# EAGLE design Atmega1280_xmem_512K (EAGLE 7.1.0)
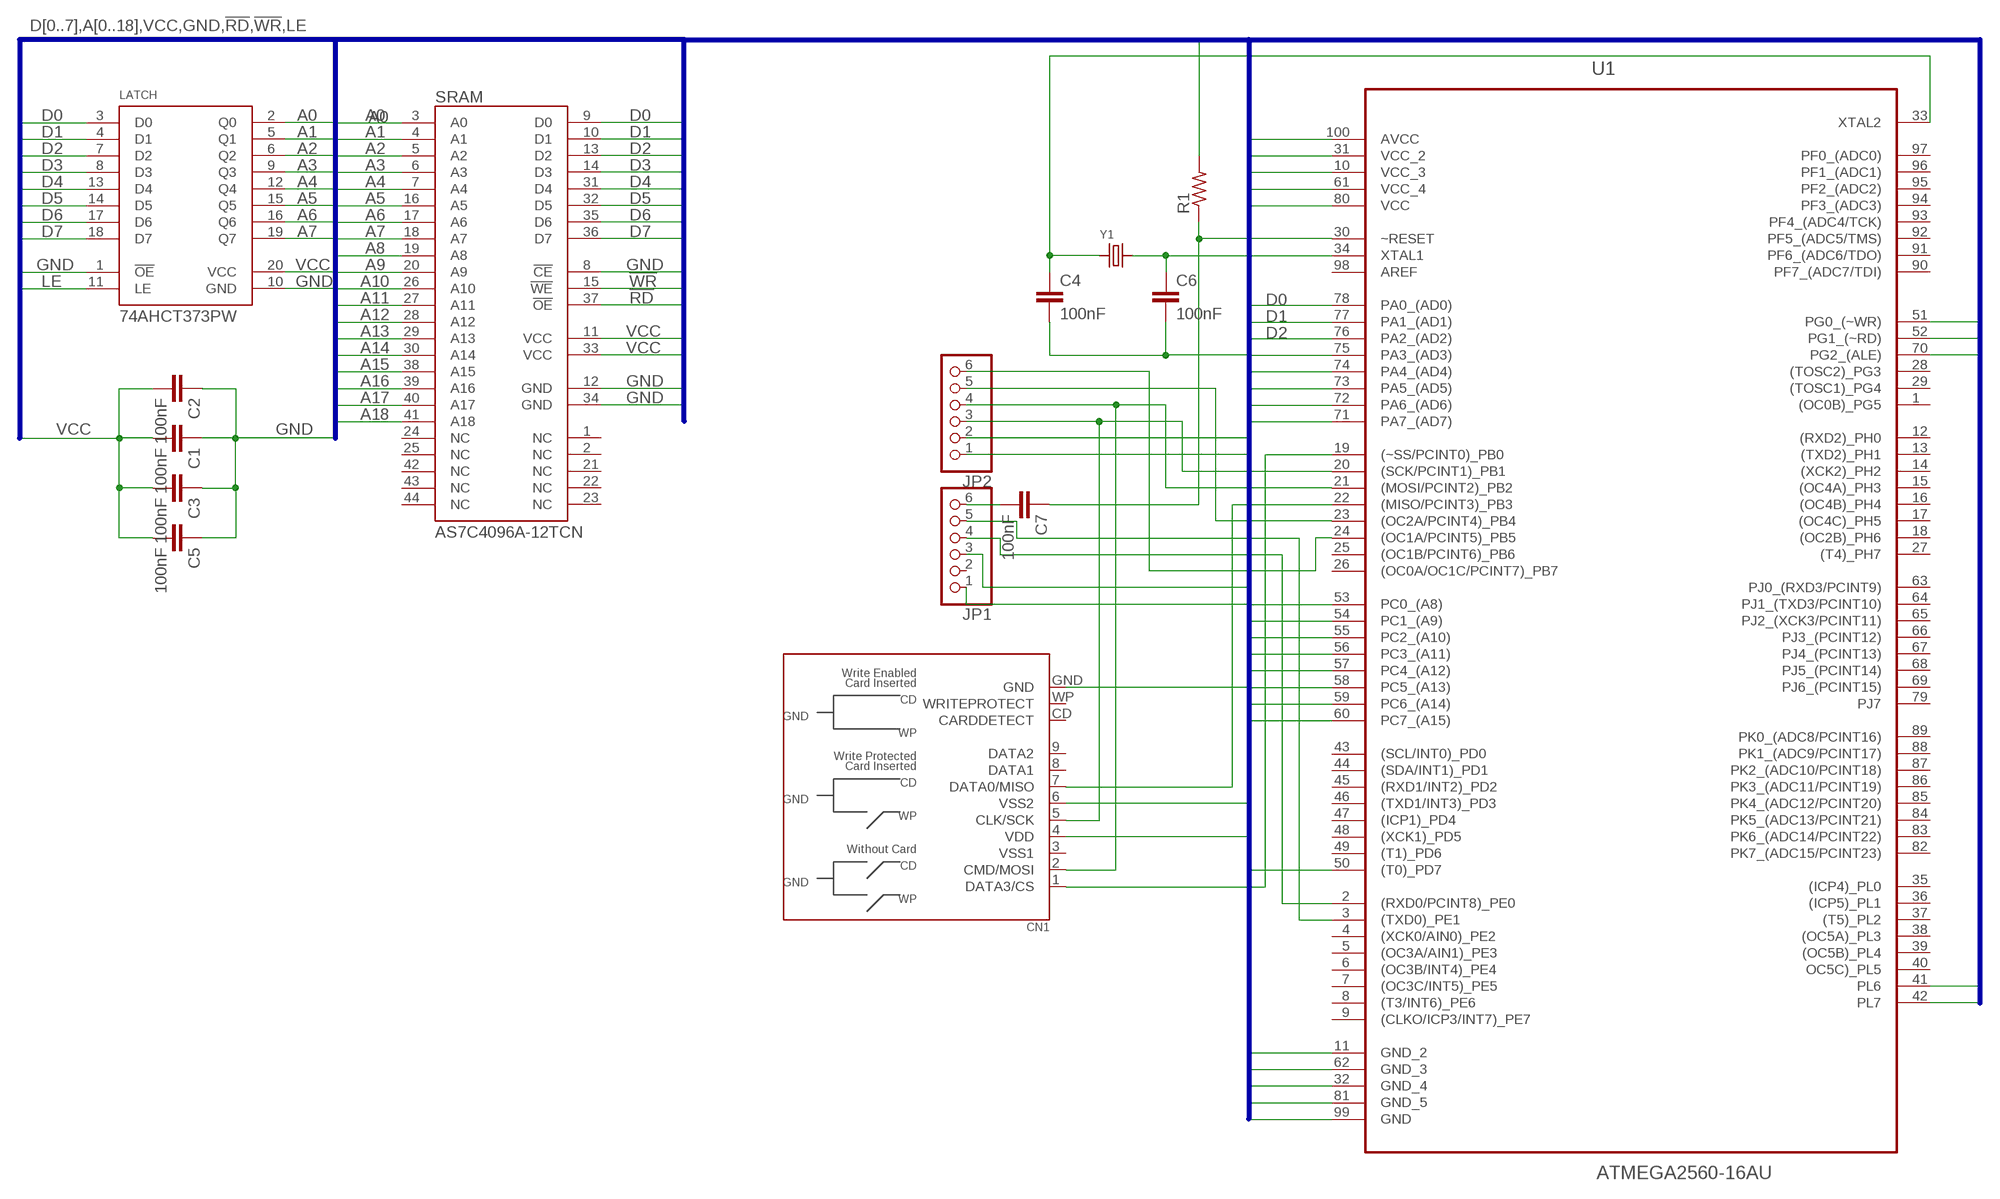
[diagram p0: schematic, sheet 1]

## Parts
C1  100nF  C-EUC0603  [C0603]
C2  100nF  C-EUC0603  [C0603]
C3  100nF  C-EUC0603  [C0603]
C4  100nF  C-EUC0603  [C0603]
C5  100nF  C-EUC0603  [C0603]
C6  100nF  C-EUC0603  [C0603]
C7  100nF  C-EUC0603  [C0603]
CN1  SDCARD  [SDCARD_SMT_4U06132]
JP1  HEADER-1X6  [1X06_OVAL]
JP2  HEADER-1X6  [1X06_OVAL]
LATCH  74AHCT373PW  [TSSOP20]
R1  R-US_R0603  [R0603]
SRAM  AS7C4096A-12TCN  [TSOP44-II]
U1  ATMEGA2560-16AU  [QFP50P1600X1600X120-100N]
Y1  CRYSTALSMD  [HC49UP]

## Nets
!RD: SRAM.37(!OE) U1.52(PG1_(~RD))
!WR: SRAM.15(!WE) U1.51(PG0_(~WR))
A0: LATCH.2(Q0) SRAM.3(A0)
A1: LATCH.5(Q1) SRAM.4(A1)
A2: LATCH.6(Q2) SRAM.5(A2)
A3: LATCH.9(Q3) SRAM.6(A3)
A4: LATCH.12(Q4) SRAM.7(A4)
A5: LATCH.15(Q5) SRAM.16(A5)
A6: LATCH.16(Q6) SRAM.17(A6)
A7: LATCH.19(Q7) SRAM.18(A7)
A8: SRAM.19(A8) U1.53(PC0_(A8))
A9: SRAM.20(A9) U1.54(PC1_(A9))
A10: SRAM.26(A10) U1.55(PC2_(A10))
A11: SRAM.27(A11) U1.56(PC3_(A11))
A12: SRAM.28(A12) U1.57(PC4_(A12))
A13: SRAM.29(A13) U1.58(PC5_(A13))
A14: SRAM.30(A14) U1.59(PC6_(A14))
A15: SRAM.38(A15) U1.60(PC7_(A15))
A16: SRAM.39(A16) U1.50((T0)_PD7)
A17: SRAM.40(A17) U1.42(PL7)
A18: SRAM.41(A18) U1.41(PL6)
D0: LATCH.3(D0) SRAM.9(D0) U1.78(PA0_(AD0))
D1: LATCH.4(D1) SRAM.10(D1) U1.77(PA1_(AD1))
D2: LATCH.7(D2) SRAM.13(D2) U1.76(PA2_(AD2))
D3: LATCH.8(D3) SRAM.14(D3) U1.75(PA3_(AD3))
D4: LATCH.13(D4) SRAM.31(D4) U1.74(PA4_(AD4))
D5: LATCH.14(D5) SRAM.32(D5) U1.73(PA5_(AD5))
D6: LATCH.17(D6) SRAM.35(D6) U1.72(PA6_(AD6))
D7: LATCH.18(D7) SRAM.36(D7) U1.71(PA7_(AD7))
GND [power]: C1.1 C2.1 C3.1 C4.2 C5.1 C6.2 CN1.6(VSS2) CN1.GND JP1.1 JP2.1 LATCH.1(!OE) LATCH.10(GND) SRAM.8(!CE) SRAM.12(GND) SRAM.34(GND) U1.11(GND_2) U1.32(GND_4) U1.62(GND_3) U1.81(GND_5) U1.99(GND)
LE: LATCH.11(LE) U1.70(PG2_(ALE))
N$2: C6.1 U1.34(XTAL1) Y1.2
N$3: C4.1 U1.33(XTAL2) Y1.1
N$4: C7.1 R1.1 U1.30(~RESET)
N$5: C7.2 JP1.6
N$6: JP1.5 U1.3((TXD0)_PE1)
N$7: JP1.4 U1.2((RXD0/PCINT8)_PE0)
N$8: CN1.5(CLK/SCK) JP2.3 U1.20((SCK/PCINT1)_PB1)
N$9: CN1.2(CMD/MOSI) JP2.4 U1.21((MOSI/PCINT2)_PB2)
N$10: JP2.5 U1.23((OC2A/PCINT4)_PB4)
N$11: JP2.6 U1.24((OC1A/PCINT5)_PB5)
N$12: CN1.7(DATA0/MISO) U1.22((MISO/PCINT3)_PB3)
N$13: CN1.1(DATA3/CS) U1.19((~SS/PCINT0)_PB0)
VCC [power]: C1.2 C2.2 C3.2 C5.2 CN1.4(VDD) JP1.3 JP2.2 LATCH.20(VCC) R1.2 SRAM.11(VCC) SRAM.33(VCC) U1.10(VCC_3) U1.31(VCC_2) U1.61(VCC_4) U1.80(VCC) U1.100(AVCC)
Unconnected: CN1.3(VSS1) CN1.8(DATA1) CN1.9(DATA2) CN1.CD(CARDDETECT) CN1.WP(WRITEPROTECT) JP1.2 SRAM.1(NC) SRAM.2(NC) SRAM.21(NC) SRAM.22(NC) SRAM.23(NC) SRAM.24(NC) SRAM.25(NC) SRAM.42(NC) SRAM.43(NC) SRAM.44(NC) U1.1((OC0B)_PG5) U1.4((XCK0/AIN0)_PE2) U1.5((OC3A/AIN1)_PE3) U1.6((OC3B/INT4)_PE4) U1.7((OC3C/INT5)_PE5) U1.8((T3/INT6)_PE6) U1.9((CLKO/ICP3/INT7)_PE7) U1.12((RXD2)_PH0) U1.13((TXD2)_PH1) U1.14((XCK2)_PH2) U1.15((OC4A)_PH3) U1.16((OC4B)_PH4) U1.17((OC4C)_PH5) U1.18((OC2B)_PH6) U1.25((OC1B/PCINT6)_PB6) U1.26((OC0A/OC1C/PCINT7)_PB7) U1.27((T4)_PH7) U1.28((TOSC2)_PG3) U1.29((TOSC1)_PG4) U1.35((ICP4)_PL0) U1.36((ICP5)_PL1) U1.37((T5)_PL2) U1.38((OC5A)_PL3) U1.39((OC5B)_PL4) U1.40(OC5C)_PL5) U1.43((SCL/INT0)_PD0) U1.44((SDA/INT1)_PD1) U1.45((RXD1/INT2)_PD2) U1.46((TXD1/INT3)_PD3) U1.47((ICP1)_PD4) U1.48((XCK1)_PD5) U1.49((T1)_PD6) U1.63(PJ0_(RXD3/PCINT9)) U1.64(PJ1_(TXD3/PCINT10)) U1.65(PJ2_(XCK3/PCINT11)) U1.66(PJ3_(PCINT12)) U1.67(PJ4_(PCINT13)) U1.68(PJ5_(PCINT14)) U1.69(PJ6_(PCINT15)) U1.79(PJ7) U1.82(PK7_(ADC15/PCINT23)) U1.83(PK6_(ADC14/PCINT22)) U1.84(PK5_(ADC13/PCINT21)) U1.85(PK4_(ADC12/PCINT20)) U1.86(PK3_(ADC11/PCINT19)) U1.87(PK2_(ADC10/PCINT18)) U1.88(PK1_(ADC9/PCINT17)) U1.89(PK0_(ADC8/PCINT16)) U1.90(PF7_(ADC7/TDI)) U1.91(PF6_(ADC6/TDO)) U1.92(PF5_(ADC5/TMS)) U1.93(PF4_(ADC4/TCK)) U1.94(PF3_(ADC3)) U1.95(PF2_(ADC2)) U1.96(PF1_(ADC1)) U1.97(PF0_(ADC0)) U1.98(AREF)

## Buses
D[0..7],A[0..18],VCC,GND,!RD,!WR,LE

## Library data of the parts
C1-C7 = resistor:C-EU: CAPACITOR, European symbol
CN1 = microbuilder:SDCARD: SD Card Reader 06132 = Inexpensive SMT 19646 = Push/Pull SMT
JP1 JP2 = OLED_mod:HEADER-1X6: PIN HEADER
LATCH = andy:74AHCT373PW
R1 = resistor:R-US_: RESISTOR, American symbol
SRAM = andy:AS7C4096A-12TCN
U1 = Atmel_By_element14_Batch_1-00:ATMEGA2560-16AU: Microcontroller; DESCRIPTION: Microcontroller; MPN: ATMEGA2560-16AU; OC_FARNELL: 1288330; OC_NEWARK: 23M5051; PACKAGE: LQFP-100; SUPPLIER: ATMEL
Y1 = OLED_mod:CRYSTAL: Crystals HC49UP - Surface Mount Crystal 4.0MHz 18pF +/-30ppm Surface Mount Crystal [Digikey: 535-9857-1-ND] 12.0 MHz Surface Mount Crystal [Digikey: 535-9869-6-ND] 25.0 MHz Surface Mount Crystal [Digikey: 535-9078-1-ND] 2.5 x 2.0mm - MEMs SMT Crystal 16.0 MHz 10pF 20ppm 2.5 x 2.0mm Crystal [Digikey -40-85°C: 535-10923-1-ND] 3.2 x 2.5mm - MEMs SMT Crystal 12.0 MHz 8pF 15ppm 3.2 x 2.5mm Crystal [Digikey: -10-70°C: 644-1047-1-ND -40-125°C: 644-1128-1-ND] 16.0 MHz 8pF 15ppm 3.2 x 2.5mm Crystal [Digikey: -10-70°C: 644-1049-1-ND -40-125°C: 644-1129-2-ND] 16.0 MHz 10pF 10ppm 3.2 x 2.5mm Crystal [Digikey: 644-1100-1-ND] 27.12 MHz 18pF 30ppm 3.2 x 2.5mm Crystal [Digikey: 887-1424-1-ND] 27.12MHz 10pF 10ppm 3.2 x 2.5mm Crystal [Digikey: 887-1329-1-ND] 4.9 x 1.8mm - MEMs SMT Crystal 32.768 KHz 12.5pF 20ppm 4.9 x 1.8mm Crystal [Digikey: SE2415CT-ND] 8.0 x 3.8mm - Surface Mount Crystal 32.768kHz 12.5pF 20ppm -40°C-85°C [Digikey: 535-9166-2-ND] Cylinder 32.768KHz Cylinder Crystal (2x6mm body) [Ex. Digikey: 300-8341-2-ND]

## Net classes
0 default: width 0.254 mm
1 power: width 0.406 mm

## Board
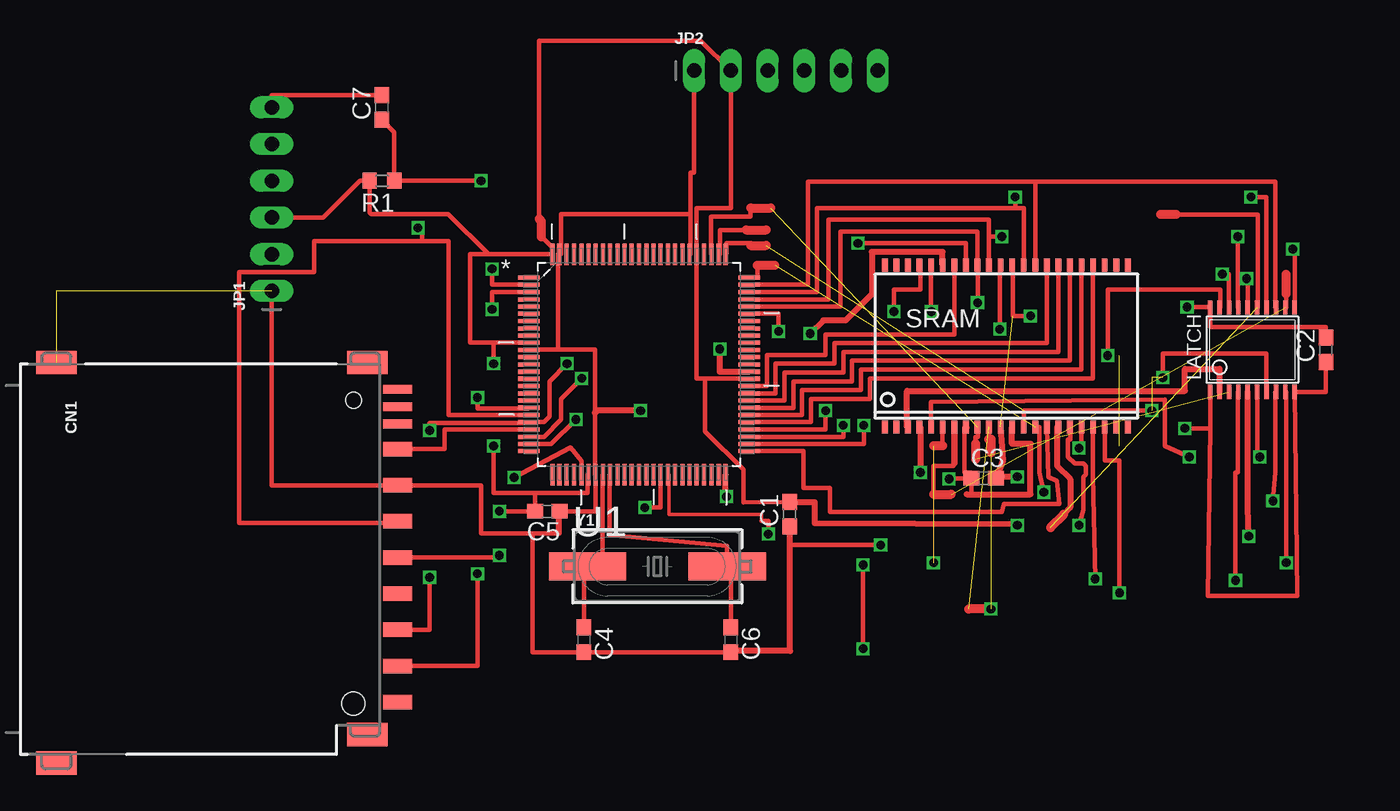
[diagram p1: board, top side]
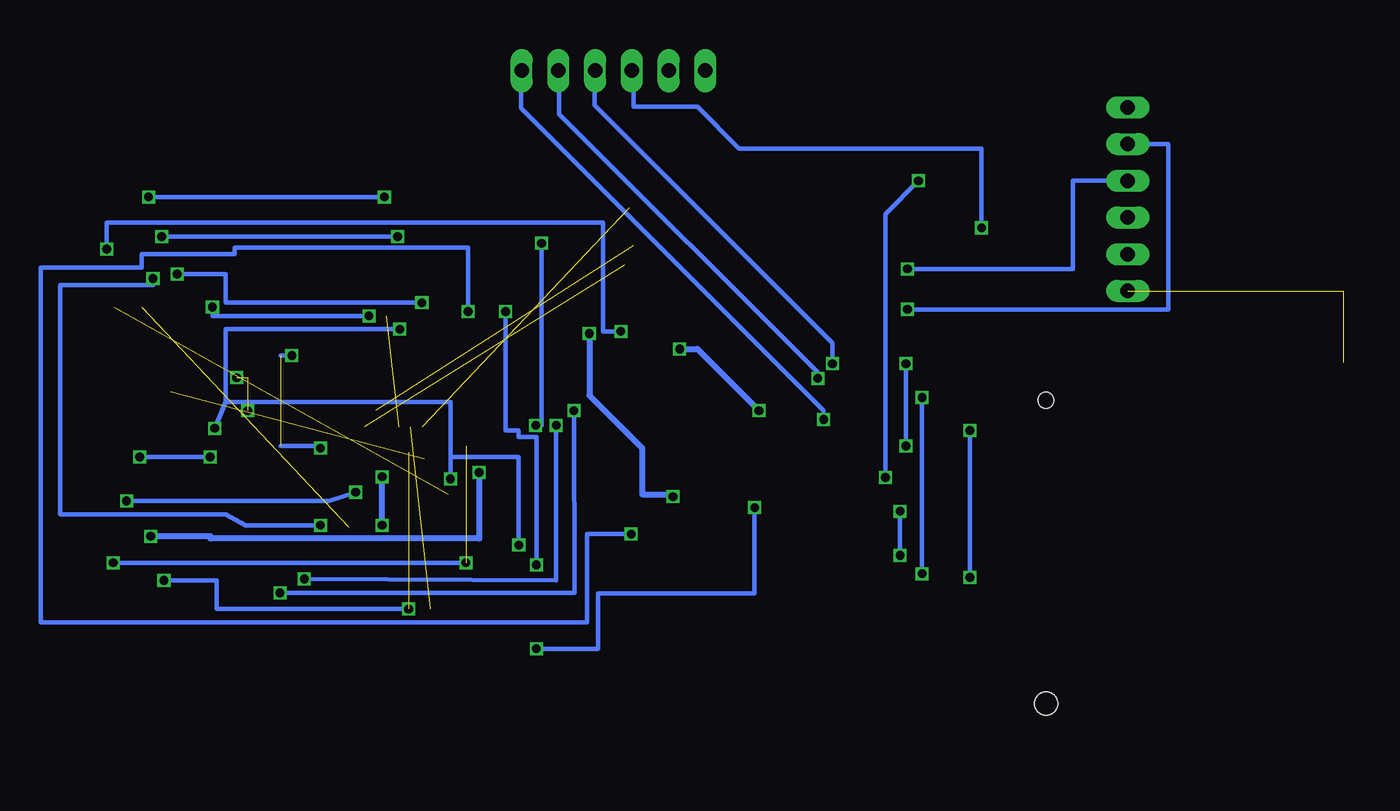
[diagram p2: board, bottom side, seen from below]

No outline drawn. Coordinates in mm, seen from the top.
Copper layers (1*16): Top 0.035mm / dielectric 1.5mm / Bottom 0.035mm
Design rules "ITead_rule *": minimum track width 10mil, minimum drill 16mil, track to track 10mil, track to pad 10mil, pad to pad 6mil, via to via 6mil, smd to smd 0mil, copper to edge 12mil, drill to drill 12mil, minimum pad ring 10mil, minimum via ring 6mil, stop-mask expansion 2mil, vias tented up to drill 100mil, thermal gap 10mil
vRestrict: area 82.5,-10.2 to 92.7,7.6; area 78,8.4 to 85.6,13.5

### Footprints (pad centres in the part's own frame; a part is rotated, then mirrored left to right if it is on the bottom)
C0603 = smd 1.1 x 1: 1 -0.85,0; 2 0.85,0
SDCARD_SMT_4U06132 = smd 1 x 2.008: 1 6.88,11.254; 2 4.38,11.254; 3 1.88,11.254; 4 -0.62,11.254; 5 -3.12,11.254; 6 -5.62,11.254; 7 -8.12,11.254; 9 9.38,11.254 | smd 0.6 x 2.008: 8 -9.845,11.254; CD -11.045,11.254; WP -12.245,11.254 | smd 1.6 x 2.8: GND -14.1,-12.35; NC1 -14.1,9.15; NC2 11.631,9.15; NC3 13.6,-12.35 | hole 1.6: 9.5,8.2 | hole 1.1: -11.5,8.2
1X06_OVAL = drill 1 long: 1 -6.35,0; 2 -3.81,0; 3 -1.27,0; 4 1.27,0; 5 3.81,0; 6 6.35,0
TSSOP20 = smd 0.305 x 0.991: 1 -2.925,-2.918; 2 -2.275,-2.918; 3 -1.625,-2.918; 4 -0.975,-2.918; 5 -0.325,-2.918; 6 0.325,-2.918; 7 0.975,-2.918; 8 1.625,-2.918; 9 2.275,-2.918; 10 2.925,-2.918; 11 2.925,2.918; 12 2.275,2.918; 13 1.625,2.918; 14 0.975,2.918; 15 0.325,2.918; 16 -0.325,2.918; 17 -0.975,2.918; 18 -1.625,2.918; 19 -2.275,2.918; 20 -2.925,2.918
R0603 = smd 1 x 1.1: 1 -0.85,0; 2 0.85,0
TSOP44-II = smd 0.4 x 0.9: 1 -8.4,-5.6; 2 -7.6,-5.6; 3 -6.8,-5.6; 4 -6,-5.6; 5 -5.2,-5.6; 6 -4.4,-5.6; 7 -3.6,-5.6; 8 -2.8,-5.6; 9 -2,-5.6; 10 -1.2,-5.6; 11 -0.4,-5.6; 12 0.4,-5.6; 13 1.2,-5.6; 14 2,-5.6; 15 2.8,-5.6; 16 3.6,-5.6; 17 4.4,-5.6; 18 5.2,-5.6; 19 6,-5.6; 20 6.8,-5.6; 21 7.6,-5.6; 22 8.4,-5.6; 23 8.4,5.6; 24 7.6,5.6; 25 6.8,5.6; 26 6,5.6; 27 5.2,5.6; 28 4.4,5.6; 29 3.6,5.6; 30 2.8,5.6; 31 2,5.6; 32 1.2,5.6; 33 0.4,5.6; 34 -0.4,5.6; 35 -1.2,5.6; 36 -2,5.6; 37 -2.8,5.6; 38 -3.6,5.6; 39 -4.4,5.6; 40 -5.2,5.6; 41 -6,5.6; 42 -6.8,5.6; 43 -7.6,5.6; 44 -8.4,5.6
QFP50P1600X1600X120-100N = smd 1.473 x 0.279: 1 -7.62,5.994; 2 -7.62,5.512; 3 -7.62,5.004; 4 -7.62,4.496; 5 -7.62,3.988; 6 -7.62,3.505; 7 -7.62,2.997; 8 -7.62,2.489; 9 -7.62,2.007; 10 -7.62,1.499; 11 -7.62,0.991; 12 -7.62,0.508; 13 -7.62,0; 14 -7.62,-0.508; 15 -7.62,-0.991; 16 -7.62,-1.499; 17 -7.62,-2.007; 18 -7.62,-2.489; 19 -7.62,-2.997; 20 -7.62,-3.505; 21 -7.62,-3.988; 22 -7.62,-4.496; 23 -7.62,-5.004; 24 -7.62,-5.512; 25 -7.62,-5.994; 51 7.62,-5.994; 52 7.62,-5.512; 53 7.62,-5.004; 54 7.62,-4.496; 55 7.62,-3.988; 56 7.62,-3.505; 57 7.62,-2.997; 58 7.62,-2.489; 59 7.62,-2.007; 60 7.62,-1.499; 61 7.62,-0.991; 62 7.62,-0.508; 63 7.62,0; 64 7.62,0.508; 65 7.62,0.991; 66 7.62,1.499; 67 7.62,2.007; 68 7.62,2.489; 69 7.62,2.997; 70 7.62,3.505; 71 7.62,3.988; 72 7.62,4.496; 73 7.62,5.004; 74 7.62,5.512; 75 7.62,5.994 | smd 0.279 x 1.473: 26 -5.994,-7.62; 27 -5.512,-7.62; 28 -5.004,-7.62; 29 -4.496,-7.62; 30 -3.988,-7.62; 31 -3.505,-7.62; 32 -2.997,-7.62; 33 -2.489,-7.62; 34 -2.007,-7.62; 35 -1.499,-7.62; 36 -0.991,-7.62; 37 -0.508,-7.62; 38 0,-7.62; 39 0.508,-7.62; 40 0.991,-7.62; 41 1.499,-7.62; 42 2.007,-7.62; 43 2.489,-7.62; 44 2.997,-7.62; 45 3.505,-7.62; 46 3.988,-7.62; 47 4.496,-7.62; 48 5.004,-7.62; 49 5.512,-7.62; 50 5.994,-7.62; 76 5.994,7.62; 77 5.512,7.62; 78 5.004,7.62; 79 4.496,7.62; 80 3.988,7.62; 81 3.505,7.62; 82 2.997,7.62; 83 2.489,7.62; 84 2.007,7.62; 85 1.499,7.62; 86 0.991,7.62; 87 0.508,7.62; 88 0,7.62; 89 -0.508,7.62; 90 -0.991,7.62; 91 -1.499,7.62; 92 -2.007,7.62; 93 -2.489,7.62; 94 -2.997,7.62; 95 -3.505,7.62; 96 -3.988,7.62; 97 -4.496,7.62; 98 -5.004,7.62; 99 -5.512,7.62; 100 -5.994,7.62
HC49UP = smd 5.334 x 1.93: 1 -4.826,0; 2 4.826,0

### Placement (x,y rotation side)
C1  53.59,23.93 90 top
C2  90.68,35.31 90 top
C3  67.01,26.42 0 top
C4  39.37,15.24 270 top
C5  36.83,24.13 180 top
C6  49.53,15.24 270 top
C7  25.4,52.07 90 top
CN1  15.24,20.32 270 top
JP1  17.78,45.72 90 top
JP2  53.34,54.61 0 top
LATCH  85.6,35.31 0 top
R1  25.4,46.99 180 top
SRAM  68.58,35.56 0 top
U1  43.18,34.29 0 top
Y1  44.45,20.32 0 top

### Tracks (layer width: path | path; a pad name or v marks a point on that pad's centre or on a via)
!RD  (via drill 0.6)
  Top 0.305: U1.52 58.73,28.78 v58.73,30.07 | v58.32,42.67 65.78,42.67 SRAM.37
  Bottom 0.305: v58.73,30.07 58.32,30.07 v58.32,42.67
!WR
  Top 0.305: U1.51 54.56,28.3 54.56,25.76 56.39,25.76 56.39,24.08 68.28,24.08 68.43,24.64 72.24,24.64 72.08,26.21 71.48,26.52 SRAM.15
A0
  Top 0.406: SRAM.3 61.72,29.96 61.72,32.46 80.92,32.46 80.92,33.98 83.32,33.98 LATCH.2
A1  (via drill 0.6)
  Top 0.406: SRAM.4 62.64,29.96 v62.64,26.82 | v85.34,22.4 85.27,24.38 LATCH.5
  Bottom 0.406: v62.64,26.82 62.64,22.25 81.23,22.25 81.23,22.4 v85.34,22.4
A2  (via drill 0.6)
  Top 0.305: SRAM.5 63.38,31.68 63.4,31.7 79.55,31.85 79.55,28.65 v81.23,27.89 | v86.11,27.89 85.92,28.35 LATCH.6
  Bottom 0.305: v81.23,27.89 v86.11,27.89
A3  (via drill 0.6)  (1 unrouted)
  Top 0.305: LATCH.9 87.94,32.39 v87.94,20.57 | SRAM.6 64.16,29.96 64.16,28.65
  Top 0.61: 64.16,28.65 63.55,28.65
  Bottom 0.305: v87.94,20.57 v63.55,20.57
A4  (1 unrouted)
  Top 0.305: 64.92,27.28 65.08,27.43 65.08,29.96 SRAM.7 64.92,29.96 64.92,27.28 | 63.55,25.3 63.55,27.28 64.92,27.28 | LATCH.12 87.94,38.22 87.94,39.17
  Top 0.61: 87.94,39.17 87.94,40.54 | 63.55,25.3 64.77,25.3
A5  (1 unrouted)
  Top 0.305: LATCH.15 85.95,38.22 85.95,44.65 80.31,44.65
  Top 0.406: SRAM.16 72.08,29.96 72.08,27.28 73,26.36 73,24.38 72.54,23.93
  Top 0.61: 80.31,44.65 79.25,44.65 | 72.54,23.93 71.63,23.01
A6  (via drill 0.6)
  Top 0.305: SRAM.17 73,29.96 73,29.11 72.85,29.11 72.85,27.89 73.3,27.43 73.91,27.43 74.07,27.28 74.07,26.67 73.91,26.52 73.91,24.23 v73.61,23.16 | v85.19,40.23 85.27,40.23 LATCH.16
  Bottom 0.305: v73.61,23.16 78.79,23.16 80.16,23.93 91.59,23.93 91.59,39.78 85.19,39.78 v85.19,40.23
A7  (via drill 0.6)  (1 unrouted)
  Top 0.305: LATCH.19 83.36,38.22 83.36,39.47 75.59,39.47 v75.59,34.9 | v73.61,28.5 73.78,28.8 SRAM.18
  Bottom 0.305: v75.59,34.9 76.35,34.9 | 76.35,28.65 73.46,28.65 v73.61,28.5
A8  (via drill 0.6)
  Top 0.305: U1.53 57.3,29.29 v57.3,30.07 | v74.73,19.46 74.58,26.62 SRAM.19
  Bottom 0.305: v57.3,30.07 57.3,19.36 v74.73,19.46
A9  (via drill 0.6)
  Top 0.305: U1.54 56.08,29.79 v56.08,31.09 | v76.4,18.49 76.4,27.64 75.38,27.64 SRAM.20
  Bottom 0.305: v56.08,31.09 56.03,18.49 v76.4,18.49
A10
  Top 0.305: U1.55 55.07,30.3 55.07,31.9 59.13,31.9 59.13,33.33 74.58,33.33 SRAM.26
A11
  Top 0.305: U1.56 54.46,30.79 54.46,32.51 58.52,32.51 58.52,33.93 73.78,33.93 SRAM.27
A12
  Top 0.305: U1.57 53.85,31.29 53.85,33.12 57.91,33.12 57.91,34.54 72.98,34.54 SRAM.28
A13
  Top 0.305: U1.58 53.24,31.8 53.24,33.73 57.3,33.73 57.3,35.15 72.18,35.15 SRAM.29
A14
  Top 0.305: U1.59 52.63,32.28 52.63,34.34 56.69,34.34 56.69,35.76 71.38,35.76 SRAM.30
A15
  Top 0.305: U1.60 52.02,32.79 52.02,34.95 56.08,34.95 56.08,36.37 64.98,36.37 SRAM.38
A16  (via drill 0.6)
  Top 0.406: SRAM.39 64.16,41.16 64.16,42.06 59.28,42.06 59.28,39.17 57.45,37.34 55.93,37.34 v55.02,36.42 | v49.23,25.15 49.17,25.15 U1.50
  Bottom 0.406: v55.02,36.42 55.02,32.16 51.36,28.5 51.36,25.3 49.23,25.3 v49.23,25.15
A17  (via drill 0.6)
  Top 0.254: U1.42 45.26,26.67 45.26,23.93 51.66,23.93 51.66,23.47
  Top 0.305: 51.66,23.47 52.12,23.47 v52.12,22.55 | v63.4,37.95 63.38,37.95 SRAM.40
  Bottom 0.305: v52.12,22.55 55.17,22.55 55.17,16.46 92.96,16.46 92.96,41 85.95,41 85.95,41.91 79.55,41.91 79.55,42.37 63.4,42.37 v63.4,37.95
A18  (via drill 0.6)
  Top 0.305: SRAM.41 62.64,41.16 62.64,39.47 60.81,39.47 v60.81,37.95 | v58.67,20.42 v58.67,14.63 | v43.59,24.38 44.68,24.38 U1.41
  Bottom 0.305: v60.81,37.95 60.81,29.72 59.89,29.72 59.89,29.26 58.67,29.26 v58.67,20.42 | v58.67,14.63 54.41,14.63 54.41,18.44 43.59,18.44 v43.59,24.38
D0  (2 unrouted)
  Top 0.305: U1.78 48.16,41.91 48.16,44.5 50.9,44.5 50.9,45.11 | SRAM.9 66.6,29.96 66.6,29.26 66.45,29.26 66.45,28.8
  Top 0.61: 50.9,45.11 52.27,45.11 | 66.45,28.8 66.45,27.74
D1  (via drill 0.6)  (2 unrouted)
  Top 0.305: LATCH.4 84.58,32.39 84.58,26.82 84.43,26.82 v84.43,19.36 | U1.77 48.77,41.91 48.77,43.59 50.6,43.59 | SRAM.10 67.36,29.96 67.36,29.11
  Top 0.61: v67.51,17.37 65.99,17.37 | 50.6,43.59 51.97,43.59 | 67.36,29.11 67.51,29.11 67.51,28.19
  Bottom 0.305: v84.43,19.36 80.77,19.36 80.77,17.37 v67.51,17.37
D2  (via drill 0.6)  (3 unrouted)
  Top 0.305: LATCH.7 86.56,35.05 79.4,35.05 v79.4,33.38 | v78.64,31.09 69.78,31.09 SRAM.13 | U1.76 49.23,41.91 49.23,42.67 50.9,42.67 50.9,42.52
  Top 0.61: 50.9,42.52 51.97,42.52
D3  (via drill 0.6)  (1 unrouted)
  Top 0.305: LATCH.8 87.17,32.39 87.17,26.82 v87.02,24.84 | SRAM.14 70.87,29.96 70.87,26.82 v71.17,25.45 | U1.75 51.36,40.28 51.36,41.15
  Top 0.61: 51.36,41.15 52.58,41.15
  Bottom 0.305: v87.02,24.84 73,24.84 v71.17,25.45
D4
  Top 0.305: U1.74 54.86,39.8 54.86,46.94 70.58,46.94 | 70.58,46.94 SRAM.31 | LATCH.13 87.17,38.22 87.17,46.94 70.58,46.94
D5  (via drill 0.6)
  Top 0.305: U1.73 55.47,39.29 55.47,45.11 69.19,45.11 | SRAM.32 69.78,45.11 69.19,45.11 | LATCH.14 86.56,45.87 v85.5,45.87 | 69.19,45.11 v69.19,45.87
  Bottom 0.305: v69.19,45.87 v85.5,45.87
D6  (via drill 0.6)
  Top 0.305: U1.72 56.29,38.79 56.29,44.3 67.38,44.3 67.38,43.13 | SRAM.35 67.38,42.98 67.38,43.13 | LATCH.17 84.58,38.22 v84.58,43.13 | v68.28,43.13 67.38,43.13
  Bottom 0.305: v84.58,43.13 v68.28,43.13
D7  (via drill 0.6)
  Top 0.305: U1.71 57.1,38.28 57.1,43.48 66.58,43.48 SRAM.36 66.6,41.16 v66.6,38.56 | v83.52,40.54 83.97,40.54 LATCH.18
  Bottom 0.305: v66.6,38.56 80.16,38.56 80.16,40.54 v83.52,40.54
GND  (via drill 0.6)  (2 unrouted)
  Top 0.305: C6.2 C4.2 35.81,14.39 35.81,22.61 | 35.81,22.61 37.59,22.61 | 37.59,22.61 37.68,22.61 C5.1 | C5.1 40.18,24.13 U1.32 40.13,26.67 40.13,30.94 40.13,35.31 37.59,35.31 | C5.1 37.59,24.13 37.59,22.61 | 35.81,22.61 32.26,22.61 32.26,25.91 26.49,25.91 | JP1.1 17.78,25.91 26.49,25.91 | 26.49,25.91 CN1.6 | 37.59,35.31 35.56,35.31 U1.11 | 37.59,35.31 37.59,41.91 U1.99 37.8,41.91 37.8,44.7 46.74,44.7 | U1.81 46.74,41.91 46.74,44.7 | 46.74,44.7 46.74,47.55 46.99,47.55 JP2.1 | SRAM.34 68.12,41.16 v68.12,36.73 | v80.92,29.87 82.67,29.87 | 82.67,29.87 LATCH.1 | v59.89,21.79 53.59,21.79 | 88.54,32.39 90.68,32.39 C2.1 | LATCH.10 88.54,32.39 | 88.54,32.39 88.7,18.29 82.52,18.29 82.67,29.87 | 65.84,25.3 66.16,25.3 C3.1 | C3.1 64.62,26.42 v64.62,26.36 | SRAM.8 65.68,29.96 65.68,26.82 66.16,26.82 C3.1
  Top 0.406: U1.62 48.77,33.78 v48.77,35.36 | v43.28,31.09 40.28,31.09 40.13,30.94 | C1.1 53.59,21.79 53.59,14.53 53.65,14.48 49.62,14.48 C6.2 | 65.84,29.9 SRAM.8 | 65.84,25.3 70.26,25.3 70.26,28.8 68.98,28.8 SRAM.12
  Bottom 0.305: v68.12,36.73 80.16,36.73 80.16,31.7 | 80.16,31.7 v80.92,29.87 | 64.62,27.89 64.62,31.7 80.16,31.7 | v64.62,26.36 64.62,27.89 | 64.62,27.89 59.89,27.89 v59.89,21.79
  Bottom 0.406: v48.77,35.36 47.55,35.36 v43.28,31.09
LE  (via drill 0.6)
  Top 0.305: U1.70 52.83,37.8 v52.83,36.58 | v88.39,42.27 88.52,42.27 LATCH.11
  Bottom 0.305: v52.83,36.58 54.05,36.58 54.05,44.09 88.39,44.09 v88.39,42.27
N$2
  Top 0.305: U1.34 41.15,26.67 41.15,22.5 49.28,21.74 Y1.2 49.53,20.32 C6.1
N$3
  Top 0.305: U1.33 40.64,26.67 40.64,20.32 Y1.1 39.37,20.32 C4.1
N$4  (via drill 0.6)
  Top 0.305: U1.30 39.19,27.61 38.46,28.55 v34.54,26.47 | v32.26,46.99 R1.1 26.25,50.37 C7.1
  Bottom 0.305: v34.54,26.47 34.54,44.7 v32.26,46.99
N$5
  Top 0.305: C7.2 17.78,52.92 JP1.6
N$6  (via drill 0.6)
  Top 0.305: U1.3 33.02,39.29 v33.02,38.1
  Bottom 0.305: v33.02,38.1 14.99,38.1 14.99,49.53 JP1.5
N$7  (via drill 0.6)
  Top 0.305: U1.2 33.02,39.8 v33.02,40.89
  Bottom 0.305: v33.02,40.89 21.59,40.89 21.59,46.99 JP1.4
N$8  (via drill 0.6)
  Top 0.305: U1.20 30.02,30.79 30.02,42.82 28.19,42.82 | 28.19,42.82 20.73,42.82 20.73,40.69 15.54,40.69 15.54,23.32 26.49,23.32 CN1.5 | v27.89,43.74 28.19,43.74 28.19,42.82
  Bottom 0.305: JP2.3 51.97,54.61 51.97,52.12 47.55,52.12 44.65,49.23 27.89,49.23 v27.89,43.74
N$9  (via drill 0.6)
  Top 0.305: CN1.2 28.7,15.94 v28.7,19.56 | v28.7,29.72 28.7,30.23 35.56,30.23 U1.21 36.6,30.3 36.98,30.68 36.98,33.12 v38.2,34.34
  Bottom 0.305: v28.7,19.56 v28.7,29.72 | v38.2,34.34 38.2,35.76 54.66,52.22 54.66,54.56 JP2.4
N$10  (via drill 0.6)
  Top 0.305: U1.23 36.6,29.29 37.8,30.48 37.8,31.9 v39.22,33.33
  Bottom 0.305: v39.22,33.33 39.22,33.73 57.1,51.61 57.1,54.56 JP2.5
N$11  (via drill 0.6)
  Top 0.305: U1.24 37.11,28.78 v38.81,30.48
  Bottom 0.305: v38.81,30.48 38.81,31.09 59.74,52.02 59.74,54.56 JP2.6
N$12
  Top 0.305: U1.22 29.72,29.79 29.72,28.45 CN1.7
N$13  (via drill 0.6)
  Top 0.305: CN1.1 32,13.44 v32,19.81 | v32,32 32,31.24 35.56,31.24 U1.19
  Bottom 0.305: v32,19.81 v32,32
VCC  (via drill 0.6)  (1 unrouted)
  Top 0.305: CN1.4 33.53,20.94 v33.53,21.08 | v33.53,24.13 C5.2 35.98,25.4 | 35.98,25.4 39.62,25.4 39.62,26.67 U1.31 | JP1.3 21.34,44.45 23.88,46.99 R1.2 24.55,44.79 24.64,44.7 29.97,44.7 32.77,41.91 U1.100 | U1.100 31.5,41.91 31.5,35.81 33.12,35.81 | 33.12,35.81 35.56,35.81 U1.10 | 35.98,25.4 33.12,25.4 v33.12,28.65 | v33.12,34.34 33.12,35.81 | C1.2 50.39,24.75 50.39,27.03 47.75,29.67 47.75,33.33 50.77,33.33 U1.61 47.17,33.3 U1.80 47.14,41.91 | 47.14,41.91 47.14,45.11 49.53,45.11 JP2.2 47.45,56.69 36.27,56.69 36.27,44.35 | 47.14,41.91 47.14,39.42 | SRAM.33 69.04,41.16 69.04,37.64 v70.26,37.64 | v81.08,38.25 82.67,38.25 LATCH.20 82.67,36.88 90.68,36.88 C2.2 | U1.100 37.19,42.37 36.42,43.13
  Top 0.406: SRAM.11 68.33,27.66 C3.2 68.36,26.52 v69.34,26.52 | C1.2 55.32,24.78 55.32,23.32 69.28,23.25 v69.34,23.16
  Top 0.61: 36.42,43.13 36.42,44.2 36.27,44.35
  Bottom 0.305: v33.53,21.08 v33.53,24.13 | v33.12,28.65 v33.12,34.34 | v70.26,37.64 81.08,37.64 v81.08,38.25
  Bottom 0.406: v69.34,23.16 v69.34,26.52